# Altium project DiodesBoard.PrjPcb
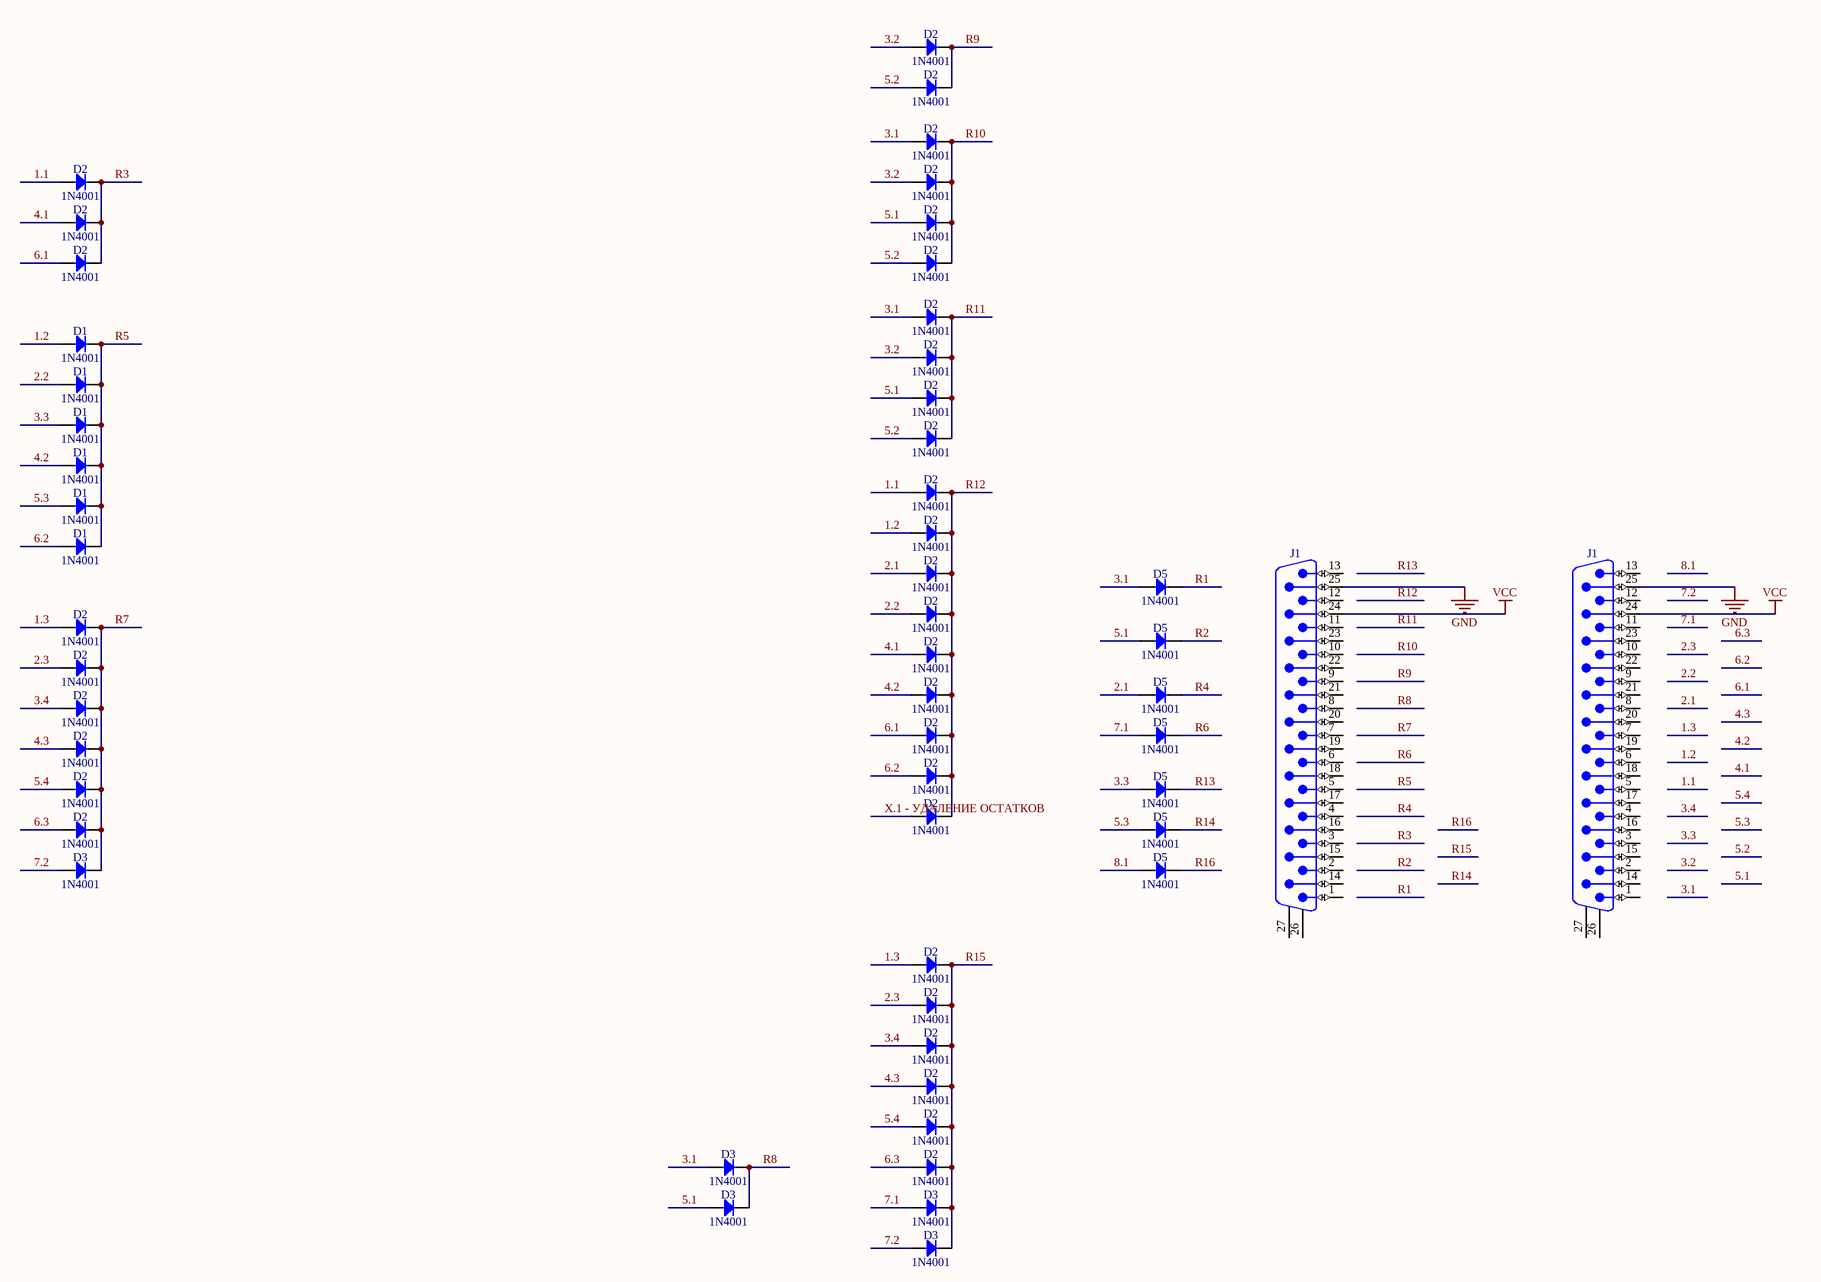
[diagram p0: DiodesScheme.SchDoc]
1 sheet, 54 parts. Net scope: global (net labels, ports and power ports of the same name join across sheets).

## Sheet DiodesScheme.SchDoc
size A1

### Parts
(Parts that share a designator on the sheet are numbered #1, #2 ... from top to bottom, then left to right.)
D1#1  1N4001  [DO-41]
D1#2  1N4001  [DO-41]
D1#3  1N4001  [DO-41]
D1#4  1N4001  [DO-41]
D1#5  1N4001  [DO-41]
D1#6  1N4001  [DO-41]
D2#1  1N4001  [DO-41]
D2#2  1N4001  [DO-41]
D2#3  1N4001  [DO-41]
D2#4  1N4001  [DO-41]
D2#5  1N4001  [DO-41]
D2#6  1N4001  [DO-41]
D2#7  1N4001  [DO-41]
D2#8  1N4001  [DO-41]
D2#9  1N4001  [DO-41]
D2#10  1N4001  [DO-41]
D2#11  1N4001  [DO-41]
D2#12  1N4001  [DO-41]
D2#13  1N4001  [DO-41]
D2#14  1N4001  [DO-41]
D2#15  1N4001  [DO-41]
D2#16  1N4001  [DO-41]
D2#17  1N4001  [DO-41]
D2#18  1N4001  [DO-41]
D2#19  1N4001  [DO-41]
D2#20  1N4001  [DO-41]
D2#21  1N4001  [DO-41]
D2#22  1N4001  [DO-41]
D2#23  1N4001  [DO-41]
D2#24  1N4001  [DO-41]
D2#25  1N4001  [DO-41]
D2#26  1N4001  [DO-41]
D2#27  1N4001  [DO-41]
D2#28  1N4001  [DO-41]
D2#29  1N4001  [DO-41]
D2#30  1N4001  [DO-41]
D2#31  1N4001  [DO-41]
D2#32  1N4001  [DO-41]
D2#33  1N4001  [DO-41]
D2#34  1N4001  [DO-41]
D3#1  1N4001  [DO-41]
D3#2  1N4001  [DO-41]
D3#3  1N4001  [DO-41]
D3#4  1N4001  [DO-41]
D3#5  1N4001  [DO-41]
D5#1  1N4001  [DO-41]
D5#2  1N4001  [DO-41]
D5#3  1N4001  [DO-41]
D5#4  1N4001  [DO-41]
D5#5  1N4001  [DO-41]
D5#6  1N4001  [DO-41]
D5#7  1N4001  [DO-41]
J1#1  D-Sub  [AMPHENOL_L717DFB25P1ATN]  (value not drawn)
J1#2  D-Sub  [AMPHENOL_L717DFB25P1ATN]  (value not drawn)

### Nets
GND: J1#1.25 J1#2.25
VCC: J1#1.24 J1#2.24
1.1: D2#4.2(A) D2#14.2(A)
1.2: D1#1.2(A) D2#15.2(A)
1.3: D2#18.2(A) D2#29.2(A)
2.1: D2#16.2(A) D5#3.2(A)
2.2: D1#2.2(A) D2#17.2(A)
2.3: D2#20.2(A) D2#30.2(A)
3.1: D2#3.2(A) D2#10.2(A) D3#2.2(A) D5#1.2(A)
3.2: D2#1.2(A) D2#5.2(A) D2#11.2(A)
3.3: D1#3.2(A) D5#5.2(A)
3.4: D2#22.2(A) D2#31.2(A)
4.1: D2#6.2(A) D2#19.2(A)
4.2: D1#4.2(A) D2#21.2(A)
4.3: D2#24.2(A) D2#32.2(A)
5.1: D2#7.2(A) D2#12.2(A) D3#3.2(A) D5#2.2(A)
5.2: D2#2.2(A) D2#9.2(A) D2#13.2(A)
5.3: D1#5.2(A) D5#6.2(A)
5.4: D2#26.2(A) D2#33.2(A)
6.1: D2#8.2(A) D2#23.2(A)
6.2: D1#6.2(A) D2#25.2(A)
6.3: D2#28.2(A) D2#34.2(A)
7.1: D3#4.2(A) D5#4.2(A)
7.2: D3#1.2(A) D3#5.2(A)
8.1: D5#7.2(A)
R1: D5#1.1(C)
R2: D5#2.1(C)
R3: D2#4.1(C) D2#6.1(C) D2#8.1(C)
R4: D5#3.1(C)
R5: D1#1.1(C) D1#2.1(C) D1#3.1(C) D1#4.1(C) D1#5.1(C) D1#6.1(C)
R6: D5#4.1(C)
R7: D2#18.1(C) D2#20.1(C) D2#22.1(C) D2#24.1(C) D2#26.1(C) D2#28.1(C) D3#1.1(C)
R8: D3#2.1(C) D3#3.1(C)
R9: D2#1.1(C) D2#2.1(C)
R10: D2#3.1(C) D2#5.1(C) D2#7.1(C) D2#9.1(C)
R11: D2#10.1(C) D2#11.1(C) D2#12.1(C) D2#13.1(C)
R12: D2#14.1(C) D2#15.1(C) D2#16.1(C) D2#17.1(C) D2#19.1(C) D2#21.1(C) D2#23.1(C) D2#25.1(C) D2#27.1(C)
R13: D5#5.1(C)
R14: D5#6.1(C)
R15: D2#29.1(C) D2#30.1(C) D2#31.1(C) D2#32.1(C) D2#33.1(C) D2#34.1(C) D3#4.1(C) D3#5.1(C)
R16: D5#7.1(C)
X.1 - УДАЛЕНИЕ ОСТАТКОВ: D2#27.2(A)

Not connected (* = marked no-connect by the designer): J1#1 1 2 3 4 5 6 7 8 9 10 11 12 13 14 15 16 17 18 19 20 21 22 23 26 27; J1#2 1 2 3 4 5 6 7 8 9 10 11 12 13 14 15 16 17 18 19 20 21 22 23 26 27

### Library data of the parts
D1#1-D1#6 D2#1-D2#34 D3#1-D3#5 D5#1-D5#7 = 1N4007: Diode; Part Number: 1N4007; Part Description: Axial Lead Standard Recovery Rectifier; Manufacturer: FAIRCHILD SEMICONDUCTOR; Voltage: 1000V; Power: 1A; Table: Diodes; Component Kind: Standard; Component Type: Standard; Device: 1N4007; PackageDescription: DO-41, Diode, Axial, Body 4.7 x 2.7mm (LxDia. Max), Pin spacing 10.16mm; Manufacturer Part Number: 1N4007; Pin Count: 2; Case: DO-41; Mounted: Yes; Socket: No; SMD: No; ComponentHeight: 2.72mm; HelpURL: \\cern.ch\dfs\Applications\Altium\Datasheets\1N4007.pdf; ComponentLink1URL: \\cern.ch\dfs\Applications\Altium\Datasheets\1N4007_Package.pdf; ComponentLink1Description: Package Drawing; Author: CERN DEM JLC; CreateDate: 20.08.2008; LatestRevisionDate: 30.10.2013
J1#1 J1#2 = AMPHENOL_L717DFB25P1ATN: Connector D-sub 25 Male; Part Description: Right Angled D-Sub 25 Male Contacts with Metal Bracket and Front Female Screwlock (UNC4-40); Part Number: AMPHENOL_L717DFB25P1ATN; Component Kind: Standard; Component Type: Standard; Pin Count: 27; Family: D-Sub; Mounted: Yes; Socket: No; SMD: No; Status: None; Manufacturer: AMPHENOL; Manufacturer Part Number: L717DFB25P1ATN; ComponentHeight: 13.4mm; HelpURL: \\cern.ch\dfs\Applications\Altium\Datasheets\AMPHENOL_L717DFB25P1ATN.pdf; Author: CERN DEM JLC; CreateDate: 03.06.2009; LatestRevisionDate: 14.07.2011; Table: AMPHENOL